# Altium schematic sheet Schematics.SchDoc
size A; SheetNumber: 1; SheetTotal: 1
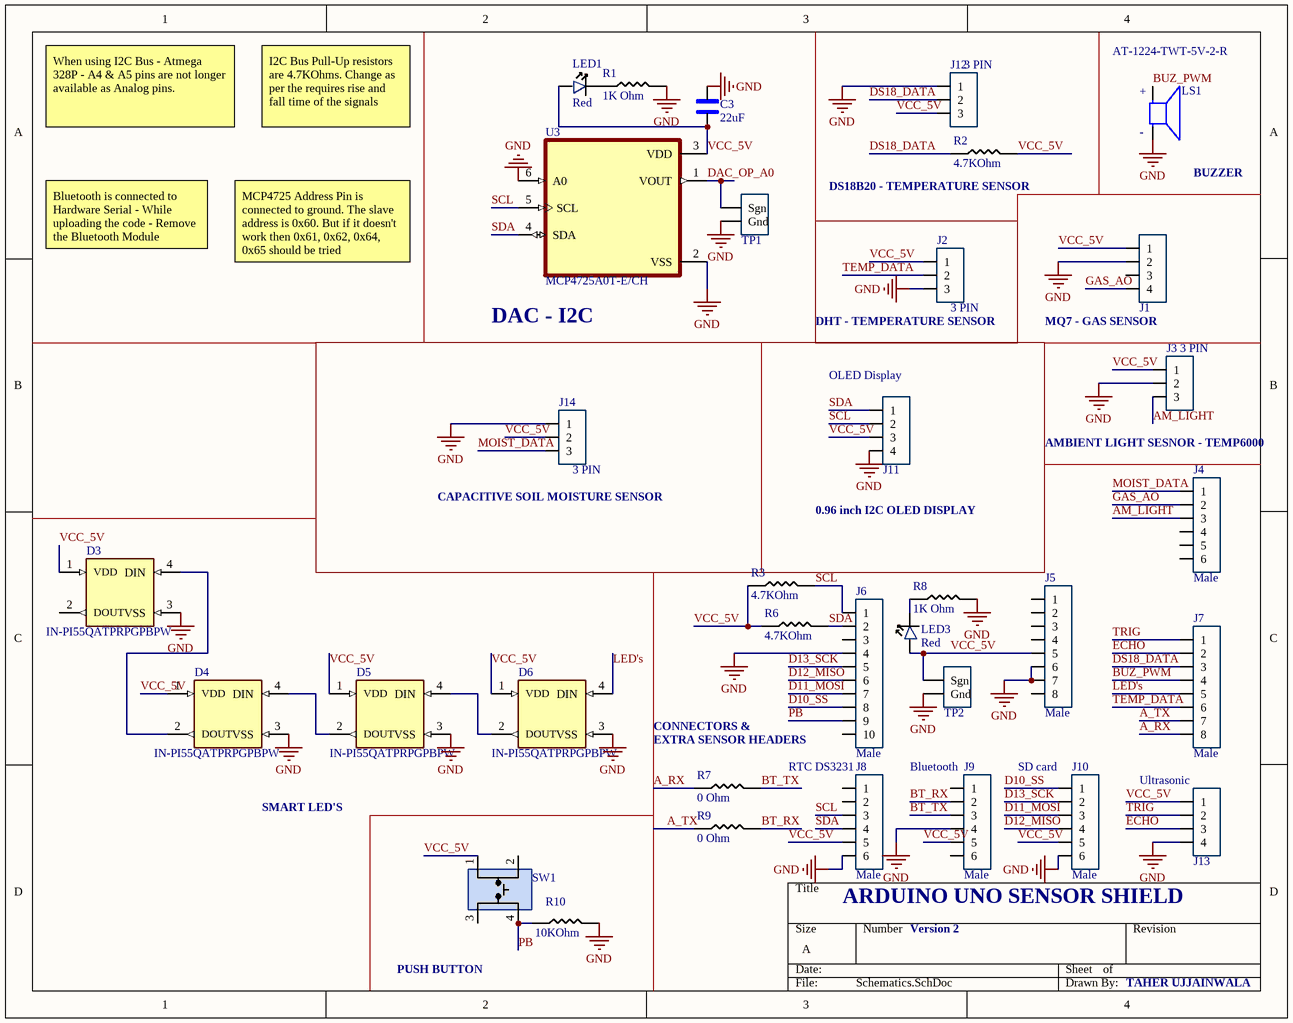
[diagram p0: Schematics.SchDoc]

## Parts
C3  22uF  [1206_Passive_Capacitor]
D3  IN-PI55QATPRPGPBPW  [SERIAL_LED]
D4  IN-PI55QATPRPGPBPW  [SERIAL_LED]
D5  IN-PI55QATPRPGPBPW  [SERIAL_LED]
D6  IN-PI55QATPRPGPBPW  [SERIAL_LED]
J1  J_4_PIN_HEADER  [4_PIN_100MIL]  (value not drawn)
J2  3 PIN  [3_PIN_100mil]
J3  3 PIN  [3_PIN_100mil]
J4  value Male  [6_PIN_ARDUINO_100mil]  (hidden comment: PPTC061LFBN-RC)
J5  value Male  [8_PIN_ARDUINO_100MIL]  (hidden comment: PPTC081LFBN-RC)
J6  value Male  [10_PIN_ARDUINO_100MIL]  (hidden comment: PPTC101LFBN-RC)
J7  value Male  [8_PIN_ARDUINO_100MIL]  (hidden comment: PPTC081LFBN-RC)
J8  value Male  [6_PIN_ARDUINO_100mil]  (hidden comment: PPTC061LFBN-RC)
J9  value Male  [6_PIN_ARDUINO_100mil]  (hidden comment: PPTC061LFBN-RC)
J10  value Male  [6_PIN_ARDUINO_100mil]  (hidden comment: PPTC061LFBN-RC)
J11  J_4_PIN_HEADER  [4_PIN_100MIL]  (value not drawn)
J12  3 PIN  [3_PIN_100mil]
J13  J_4_PIN_HEADER  [4_PIN_100MIL]  (value not drawn)
J14  3 PIN  [3_PIN_100mil]
LED1  value Red  [LED]  (hidden comment: LTST-C150CKT)
LED3  value Red  [LED]  (hidden comment: LTST-C150CKT)
LS1  AT-1224-TWT-5V-2-R  [XDCR_AT-1224-TWT-5V-2-R]
R1  value 1K Ohm  [1206_Passive_Resitor]  (hidden comment: 1k)
R2  4.7KOhm  [1206_Passive_Resitor]
R3  4.7KOhm  [1206_Passive_Resitor]
R6  4.7KOhm  [1206_Passive_Resitor]
R7  0 Ohm  [0402_Passive_Resistor]
R8  value 1K Ohm  [1206_Passive_Resitor]  (hidden comment: 1k)
R9  0 Ohm  [0402_Passive_Resistor]
R10  value 10KOhm  [1206_Passive_Resitor]  (hidden comment: 10k)
SW1  TL3305AF160QG  [Switch_JLC]  (value not drawn)
TP1  10x Probe TP  [TP10x_Probe]  (value not drawn)
TP2  10x Probe TP  [TP10x_Probe]  (value not drawn)
U3  MCP4725A0T-E/CH  [SOT95P270X145-6N]

## Blocks framed on the sheet
DHT - TEMPERATURE SENSOR: J2
DAC - I2C: J11 J14

## Nets
GND: C3.2 D3.3(VSS) D4.3(VSS) D5.3(VSS) D6.3(VSS) J1.2 J2.3 J3.2 J5.6 J5.7 J6.4 J8.6 J9.4 J10.6 J11.4 J12.1 J13.4 J14.1 LS1.N R1.2 R8.2 R10.2 TP1.2(Gnd) TP2.2(Gnd) U3.2(VSS) U3.6(A0)
A_RX: J7.8 R7.1
A_TX: J7.7 R9.1
AM_LIGHT: J3.3 J4.3
BT_RX: J9.2 R9.2
BT_TX: J9.3 R7.2
BUZ_PWM: J7.4 LS1.P
D10_SS: J6.8 J10.1
D11_MOSI: J6.7 J10.3
D12_MISO: J6.6 J10.4
D13_SCK: J6.5 J10.2
DAC_OP_A0: TP1.1(Sgn) U3.1(VOUT)
DS18_DATA: J7.3 J12.2 R2.1
ECHO: J7.2 J13.3
GAS_AO: J1.4 J4.2
LED's: D6.4(DIN) J7.5
MOIST_DATA: J4.1 J14.3
PB: J6.9 R10.1 SW1.4
SCL: J6.1 J8.3 J11.2 R3.2 U3.5(SCL)
SDA: J6.2 J8.4 J11.1 R6.2 U3.4(SDA)
TEMP_DATA: J2.2 J7.6
TRIG: J7.1 J13.2
VCC_5V: C3.1 D3.1(VDD) D4.1(VDD) D5.1(VDD) D6.1(VDD) J1.1 J2.1 J3.1 J5.5 J8.5 J9.5 J10.5 J11.3 J12.3 J13.1 J14.2 LED1.2 LED3.2 R2.2 R3.1 R6.1 SW1.1 TP2.1(Sgn) U3.3(VDD)
NetD3_4: D3.4(DIN) D4.2(DOUT)
NetD4_4: D4.4(DIN) D5.2(DOUT)
NetD5_4: D5.4(DIN) D6.2(DOUT)
NetLED1_1: LED1.1 R1.1
NetLED3_1: LED3.1 R8.1

Not connected (* = marked no-connect by the designer): D3 2(DOUT); J1 3; J4 4 5 6; J5 1 2 3 4 8; J6 3 10; J8 1 2; J9 1 6; SW1 2 3

## Notes on the sheet
- When using I2C Bus - Atmega 328P - A4 & A5 pins are not longer available as Analog pins.
- I2C Bus Pull-Up resistors are 4.7KOhms. Change as per the requires rise and fall time of the signals
- (near R2) DS18B20 - TEMPERATURE SENSOR
- BUZZER
- Bluetooth is connected to Hardware Serial - While uploading the code - Remove the Bluetooth Module
- MCP4725 Address Pin is connected to ground. The slave address is 0x60. But if it doesn't work then 0x61, 0x62, 0x64, 0x65 should be tried
- (near J1) MQ7 - GAS SENSOR
- (near J11) OLED Display
- (near J14) CAPACITIVE SOIL MOISTURE SENSOR
- AMBIENT LIGHT SESNOR - TEMP6000
- 0.96 inch I2C OLED DISPLAY
- CONNECTORS &
- (near R7) EXTRA SENSOR HEADERS
- (near J8) RTC DS3231
- (near J9) Bluetooth
- (near J10) SD card
- SMART LED'S
- (near J13) Ultrasonic
- ARDUINO UNO SENSOR SHIELD
- PUSH BUTTON
- Version 2
- TAHER UJJAINWALA
- (in symbol AT-1224-TWT-5V-2-R) +; -

## Library data of the parts
C3 = C_22uF_1206: 22µF ±20% 16V Ceramic Capacitor X5R 1206 (3216 Metric); MFR Part #: CL31A226KPHNNNE; Type: Extended; Digikey Link: https://www.digikey.com/product-detail/en/CL31A226MOCLNNC/1276-2728-1-ND/3890814/?itemSeq=304982363; Digikey Part: 1276-2728-1-ND; LCSC Part#: C12891; Value: 22uF
D3-D6 = LED_Smart_5050: Digital Series Cascade LED; DigiKey: https://www.digikey.com/product-detail/en/inolux/IN-PI55QATPRPGPBPW-60/1830-1209-1-ND/9681289; Parameter 1: *
  D6: LCSC Part#: C2843785
J1 J11 J13 = J_4_PIN_HEADER: 4 Position Header Connector 0.100" (2.54mm) Through Hole Tin
J2 J3 J12 J14 = J_3_PIN_HEADER: 3 2.54mm Straight 1 Header，Breakaway Through Hole Pin Header & Female Header ROHS; MFR Part #: C49257; Type: Extended; Datasheet: https://datasheet.lcsc.com/lcsc/1811132313_BOOMELE-Boom-Precision-Elec-C49257_C49257.pdf; LCSC Part#: C49257; Value: 3 PIN
J4 J8-J10 = JM_6_PIN_MALE_ARDUINO: 6 Position Header Connector 0.100" (2.54mm) Through Hole Tin; Digikey Link: https://www.digikey.com/product-detail/en/PPTC061LFBN-RC/S7004-ND/810145/?itemSeq=304982353; Digikey Part: S7004-ND; LCSC Part#: DNP
J5 J7 = JM_8_PIN_MALE_ARDUINO: 8 Position Header Connector 0.100" (2.54mm) Through Hole Tin; Digikey Link: https://www.digikey.com/product-detail/en/PPTC081LFBN-RC/S7006-ND/810147/?itemSeq=304982354; Digikey Part: S7006-ND; LCSC Part#: DNP
J6 = JM_10_PIN_MALE_ARDUINO: 10 Position Header Connector 0.100" (2.54mm) Through Hole Tin; Digikey Link: https://www.digikey.com/product-detail/en/PPTC101LFBN-RC/S7008-ND/810149/?itemSeq=304982352; Digikey Part: S7008-ND; LCSC Part#: DNP
LED1 LED3 = LED_1206: Red 638nm LED Indication - Discrete 1.8V 1206 (3216 Metric); Digikey Link: https://www.digikey.com/product-detail/en/LTST-C150CKT/160-1167-1-ND/269239/?itemSeq=304982368; Digikey Part: 160-1167-1-ND; LCSC Part#: C93133
LS1 = AT-1224-TWT-5V-2-R: AUDIO TRANSDUCER 5 VP-P 87 DB 2400 HZ; MF: PUI Audio,; Check_prices: https://www.snapeda.com/parts/AT-1224-TWT-5V-2-R/PUI%20Audio,%20Inc./view-part/453710/?ref=eda; Purchase-URL: https://pricing.snapeda.com/search/part/AT-1224-TWT-5V-2-R/?ref=eda; SnapEDA_Link: https://www.snapeda.com/parts/AT-1224-TWT-5V-2-R/PUI%20Audio,%20Inc./view-part/453710/?ref=snap; Value: *; MP: AT-1224-TWT-5V-2-R; Package: PUI Audio,; Price: None; Availability: In Stock; LCSC Part#: C417411
R1 R8 = R_1K_1206: 1 kOhms ±1% 0.5W, 1/2W Chip Resistor 1206 (3216 Metric) Anti-Sulfur, Moisture Resistant Thin Film; MFR Part #: 1206W4F1001T5; Digikey Link: https://www.digikey.com/product-detail/en/RNCP1206FTD1K00/RNCP1206FTD1K00CT-ND/2240675/?itemSeq=304982373; Digikey Part: RNCP1206FTD1K00CT-ND; LCSC Part#: C4410
R2 R3 R6 = R_4.7k_1206: 4.7kΩ ±1% 0.25W ±100ppm/℃ 1206 Chip Resistor - Surface Mount RoHS; MFR Part #: 1206W4F4701T5E; LCSC Part#: C17936; Datasheet: https://datasheet.lcsc.com/lcsc/1810301414_UNI-ROYAL-Uniroyal-Elec-1206W4F4701T5E_C17936.pdf; Type: Basic; Value: 4.7KOhm
R7 R9 = R_0Ohm_0402: CHIP RESISTOR - SURFACE MOUNT 0OHMS ±1% 1/16W 0402 ROHS; MFR Part #: 0402WGF0000TCE; Datasheet: https://datasheet.lcsc.com/szlcsc/Uniroyal-Elec-0402WGF0000TCE_C17168.pdf; LCSC Part#: C17168; Type: Basic; Value: 0 Ohm
R10 = R_10KOhm_1206: 10 kOhms ±5% 0.25W, 1/4W Chip Resistor 1206 (3216 Metric) Automotive AEC-Q200 Thick Film; Digikey Link: https://www.digikey.com/product-detail/en/RMCF1206JT300R/RMCF1206JT300RCT-ND/1942776/?itemSeq=304982374; Digikey Part: RMCF1206JT300RCT-ND; LCSC Part#: C17902; Type: Basic
SW1 = SW_Push_Button_JLC: Tactile Switch SPST-NO Top Actuated Surface Mount; MFR Part #: KH-4.5X4.5X4.3H-STM; LCSC Part#: C2837550; Type: Extended; DataSheet: https://datasheet.lcsc.com/lcsc/2106081532_Shenzhen-Kinghelm-Elec-KH-4.5X4.5X4.3H-STM_C2837550.pdf
TP1 TP2 = TP_10x_Probe: Test Point 300 mil centers
U3 = MCP4725A0T-E/CH: 12 Bit Digital to Analog Converter 1 SOT-23-6; MF: Microchip; Package: SOT-23-6 Microchip; Value: *; Availability: Unavailable; SnapEDA_Link: https://www.snapeda.com/parts/MCP4725A0T-E/CH/Microchip/view-part/109888/?ref=snap; Price: None; MP: MCP4725A0T-E/CH; LCSC Part#: C144198